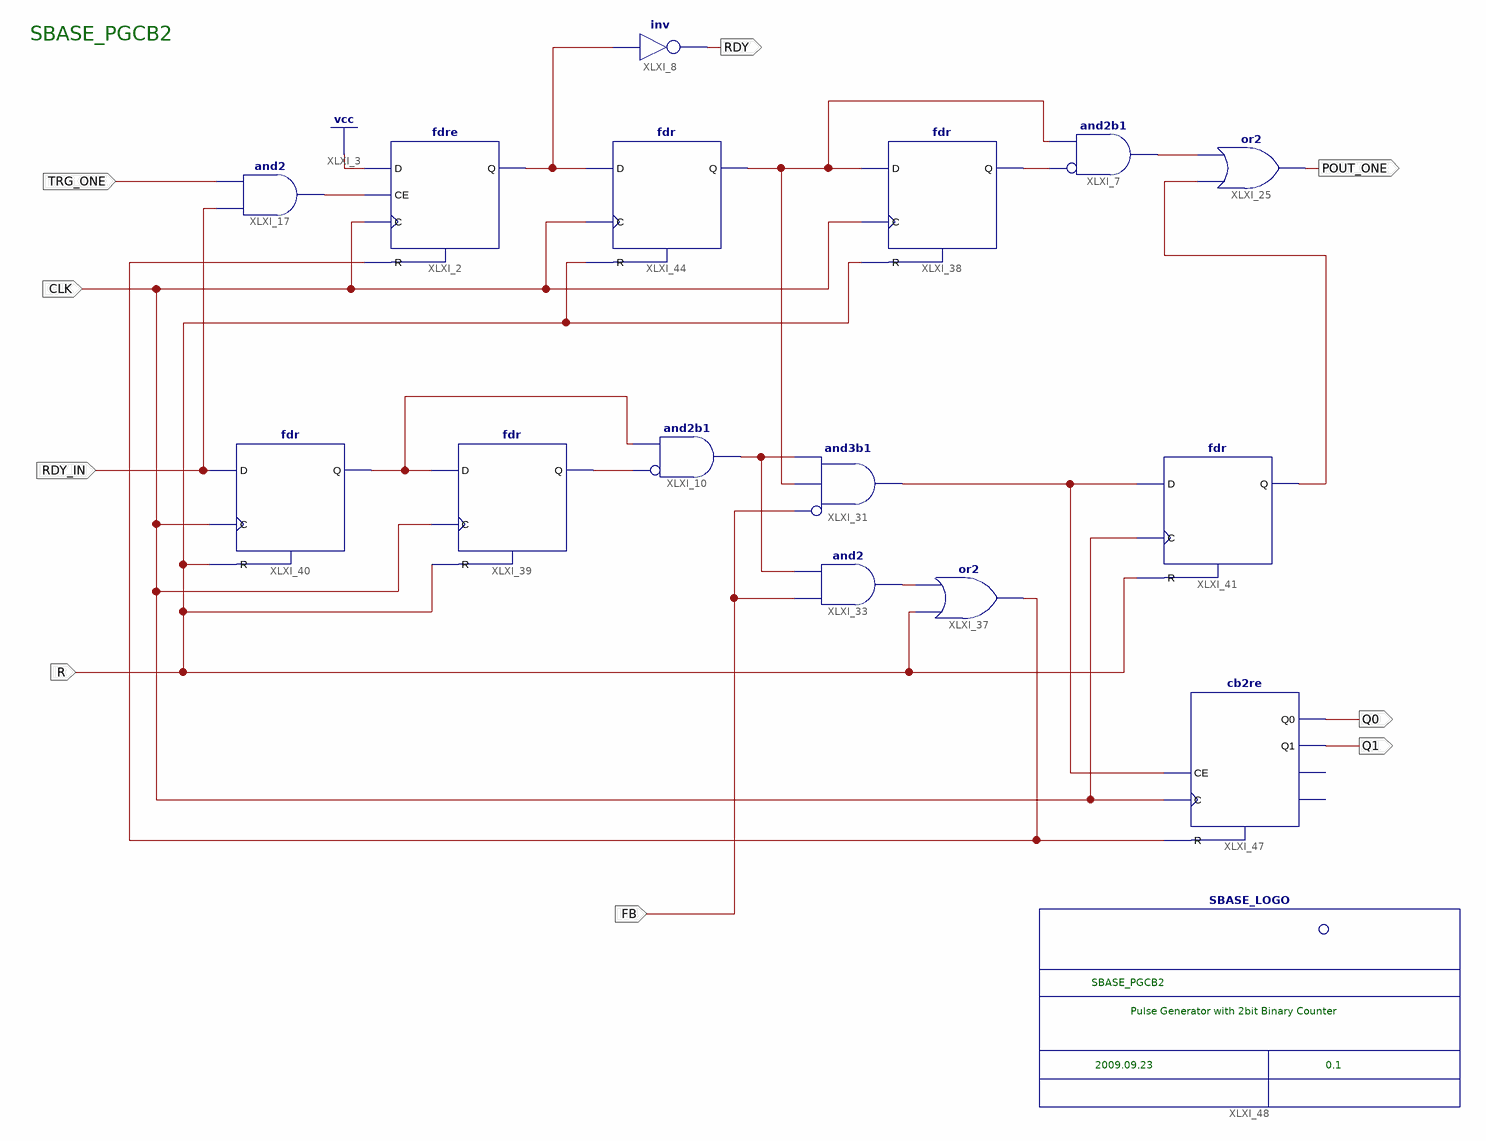
[diagram p0: schematic sheet 1]
// Xilinx ISE schematic SBASE_PGCB2.sch (spartan3a) as structural Verilog: 16 symbols, 9 ports
module SBASE_PGCB2 (
  input  RDY_IN,
  input  TRG_ONE,
  input  CLK,
  input  R,
  input  FB,
  output RDY,
  output POUT_ONE,
  output Q0,
  output Q1
);

  wire XLXN_5, XLXN_9, XLXN_25, XLXN_29, XLXN_32, XLXN_44, XLXN_48, XLXN_50, XLXN_52, XLXN_80, XLXN_81,
       XLXN_87;

  and XLXI_10 (XLXN_50, ~XLXN_9, XLXN_81);  // and2b1
  fdre XLXI_2 (.C(CLK), .CE(XLXN_25), .D(1'b1), .R(XLXN_52), .Q(XLXN_32));
  and XLXI_17 (XLXN_25, RDY_IN, TRG_ONE);
  not XLXI_8 (RDY, XLXN_32);
  and XLXI_31 (XLXN_48, ~FB, XLXN_87, XLXN_50);  // and3b1
  and XLXI_33 (XLXN_80, FB, XLXN_50);
  or XLXI_37 (XLXN_52, R, XLXN_80);
  fdr XLXI_38 (.C(CLK), .D(XLXN_87), .R(R), .Q(XLXN_5));
  fdr XLXI_39 (.C(CLK), .D(XLXN_81), .R(R), .Q(XLXN_9));
  fdr XLXI_40 (.C(CLK), .D(RDY_IN), .R(R), .Q(XLXN_81));
  fdr XLXI_41 (.C(CLK), .D(XLXN_48), .R(R), .Q(XLXN_44));
  or XLXI_25 (POUT_ONE, XLXN_44, XLXN_29);
  and XLXI_7 (XLXN_29, ~XLXN_5, XLXN_87);  // and2b1
  fdr XLXI_44 (.C(CLK), .D(XLXN_32), .R(R), .Q(XLXN_87));
  cb2re XLXI_47 (.C(CLK), .CE(XLXN_48), .R(XLXN_52), .Q0(Q0), .Q1(Q1));  // open: CEO, TC
  SBASE_LOGO XLXI_48 ();

  // Notes on the sheet:
  //   SBASE_PGCB2
  //   SBASE_PGCB2
  //   Pulse Generator with 2bit Binary Counter
  //   2009.09.23
  //   0.1
endmodule
